# Altium schematic sheet Connection Socket.SchDoc: B100AA Connection Socket
size A3
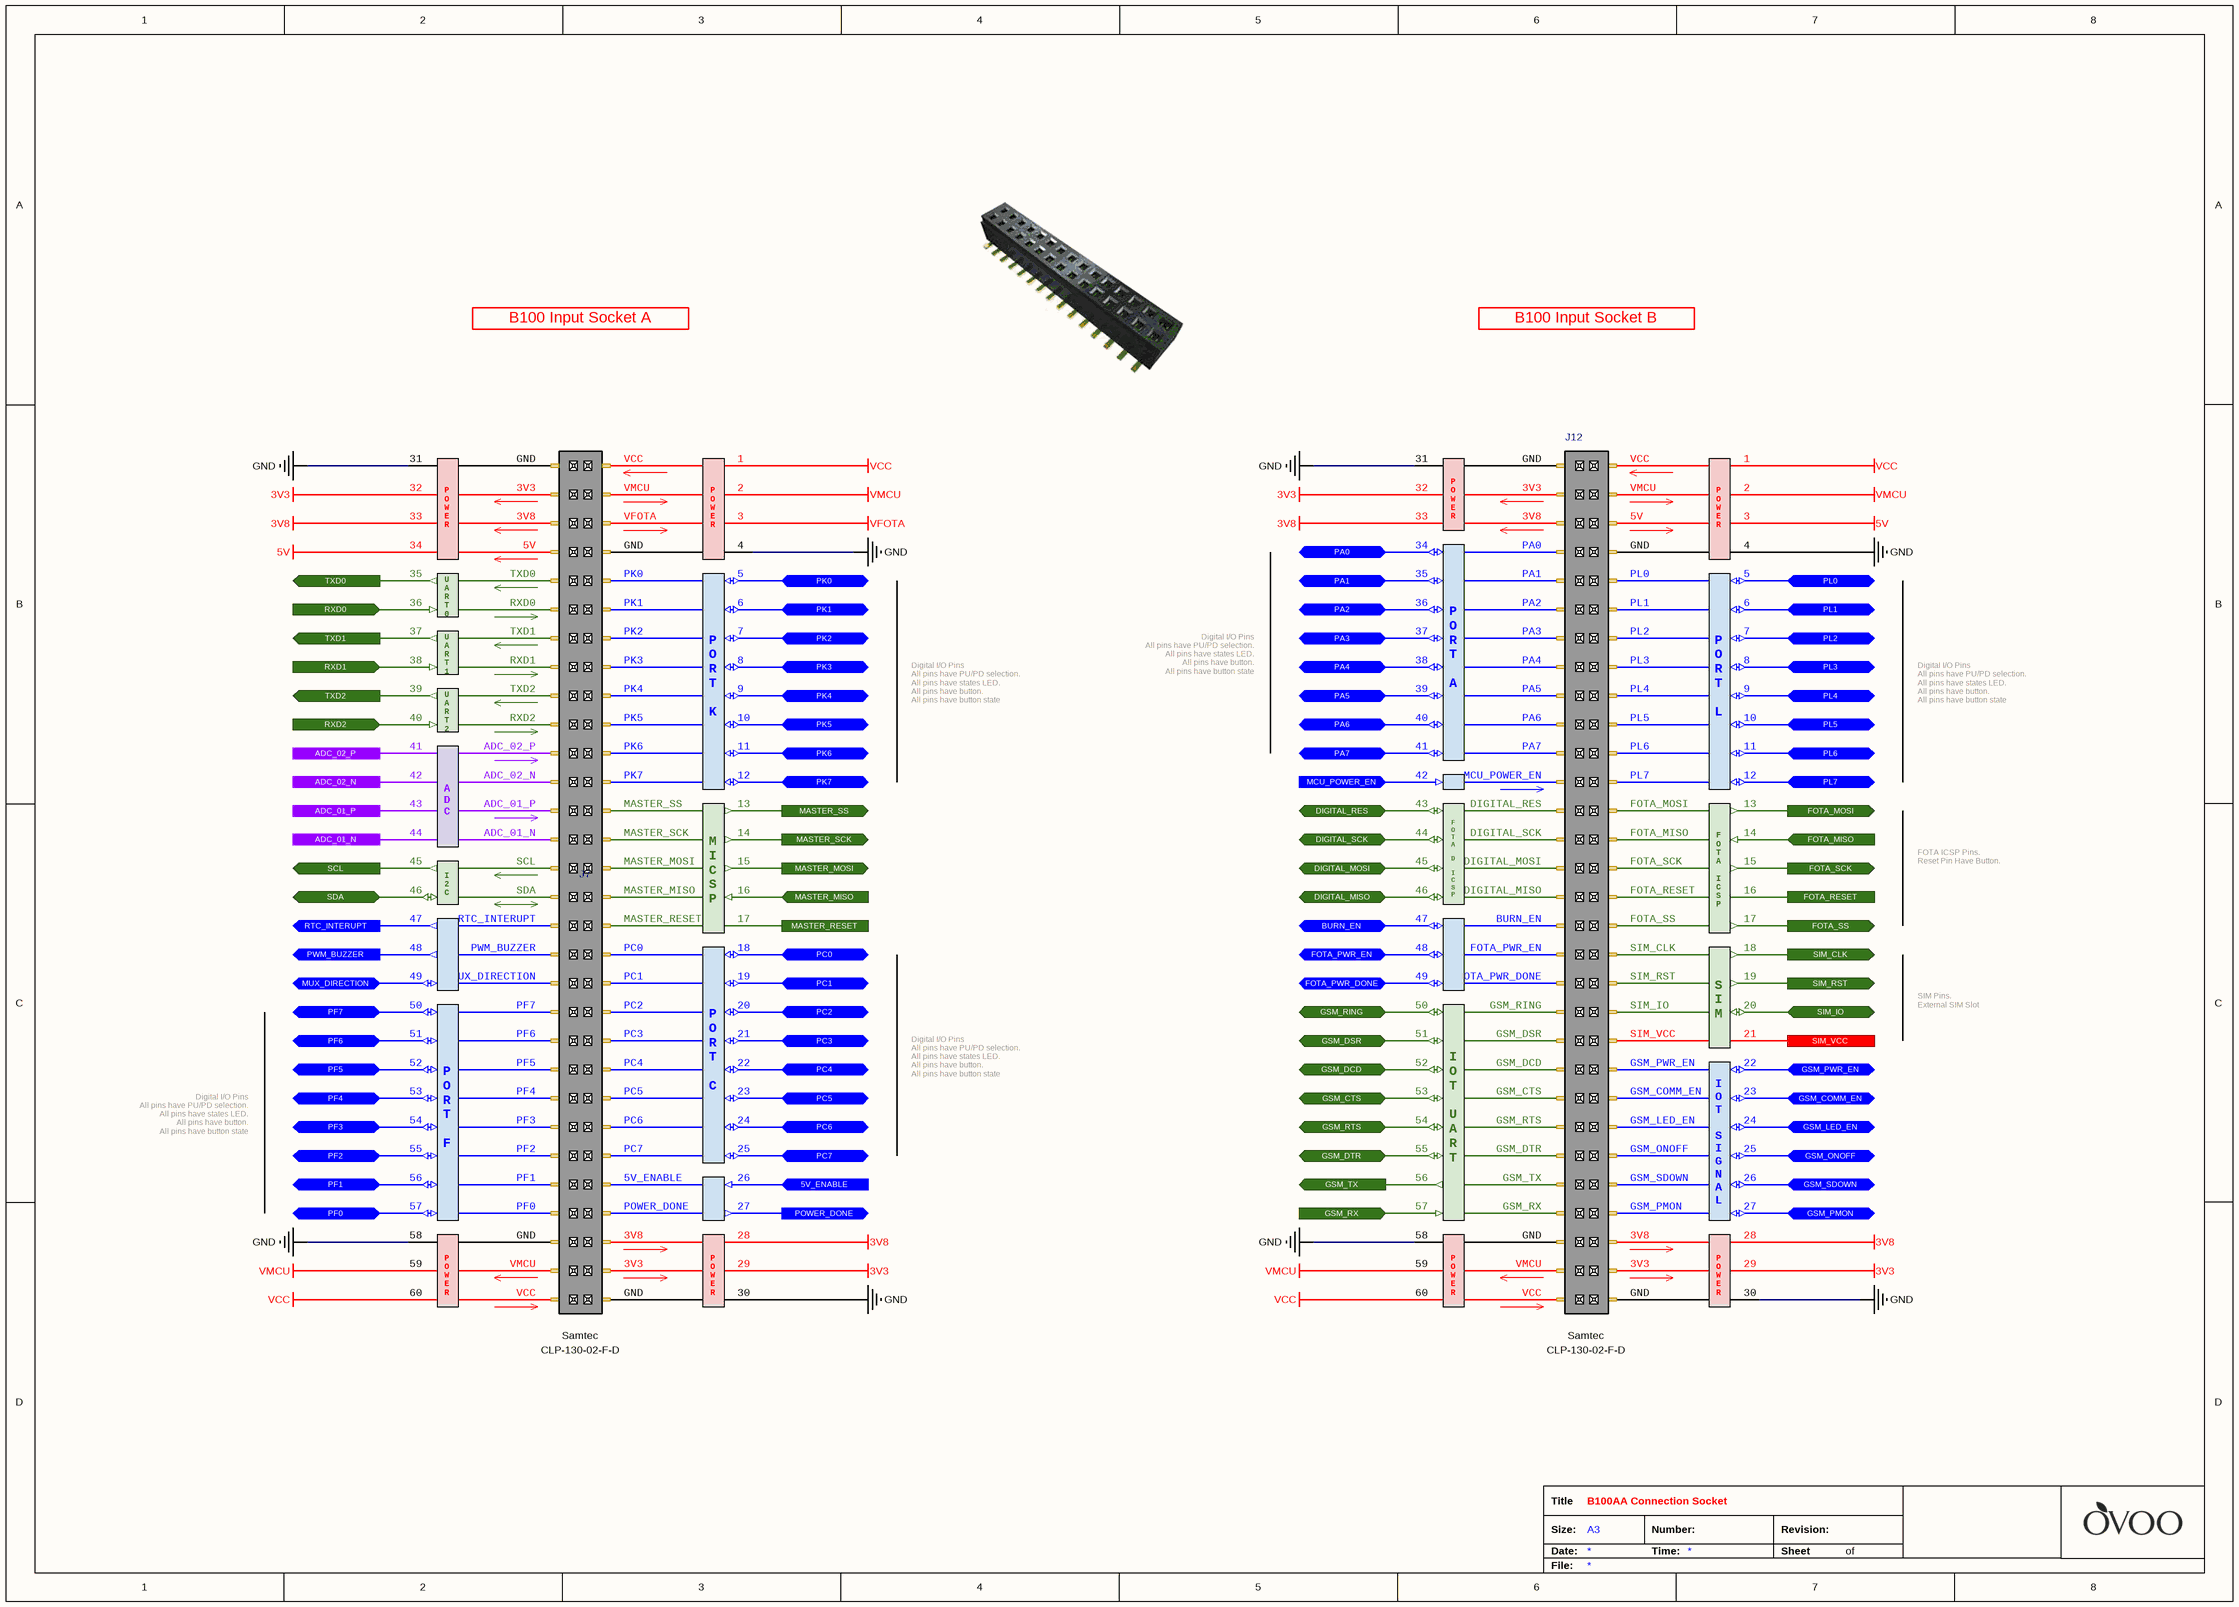
[diagram p0: Connection Socket.SchDoc]

## Parts
J7  Manufacturer Part Number: CLP-130-02-F-D  Manufacturer Name: Samtec  [SAMTEC-CLP-130-02-X-D]  (hidden comment: 1.27 mm Pitch 2x30P Female Connector)
J12  Manufacturer Part Number: CLP-130-02-F-D  Manufacturer Name: Samtec  [SAMTEC-CLP-130-02-X-D]  (hidden comment: 1.27 mm Pitch 2x30P Female Connector)

## Ports
5V_ENABLE (in), ADC_01_N, ADC_01_P, ADC_02_N, ADC_02_P, BURN_EN (bidir), DIGITAL_MISO (bidir), DIGITAL_MOSI (bidir), DIGITAL_RES (bidir), DIGITAL_SCK (bidir), FOTA_MISO (in), FOTA_MOSI (out), FOTA_PWR_DONE (bidir), FOTA_PWR_EN (bidir), FOTA_RESET, FOTA_SCK (out), FOTA_SS (out), GSM_COMM_EN (bidir), GSM_CTS (bidir), GSM_DCD (bidir), GSM_DSR (bidir), GSM_DTR (bidir), GSM_LED_EN (bidir), GSM_ONOFF (bidir), GSM_PMON (bidir), GSM_PWR_EN (bidir), GSM_RING (bidir), GSM_RTS (bidir), GSM_RX (in), GSM_SDOWN (bidir), GSM_TX (out), MASTER_MISO (in), MASTER_MOSI (out), MASTER_RESET, MASTER_SCK (out), MASTER_SS (out), MCU_POWER_EN (in), MUX_DIRECTION (bidir), PA0 (bidir), PA1 (bidir), PA2 (bidir), PA3 (bidir), PA4 (bidir), PA5 (bidir), PA6 (bidir), PA7 (bidir), PC0 (bidir), PC1 (bidir), PC2 (bidir), PC3 (bidir), PC4 (bidir), PC5 (bidir), PC6 (bidir), PC7 (bidir), PF0 (bidir), PF1 (bidir), PF2 (bidir), PF3 (bidir), PF4 (bidir), PF5 (bidir), PF6 (bidir), PF7 (bidir), PK0 (bidir), PK1 (bidir), PK2 (bidir), PK3 (bidir), PK4 (bidir), PK5 (bidir), PK6 (bidir), PK7 (bidir), PL0 (bidir), PL1 (bidir), PL2 (bidir), PL3 (bidir), PL4 (bidir), PL5 (bidir), PL6 (bidir), PL7 (bidir), POWER_DONE (out), PWM_BUZZER (out), RTC_INTERUPT (out), RXD0 (in), RXD1 (in), RXD2 (in), SCL (out), SDA (bidir), SIM_CLK (out), SIM_IO (bidir), SIM_RST (out), SIM_VCC, TXD0 (out), TXD1 (out), TXD2 (out)

## Nets
3V3: J7.29(Pin-29) J7.32(Pin-32) J12.29(Pin-29) J12.32(Pin-32)
3V8: J7.28(Pin-28) J7.33(Pin-33) J12.28(Pin-28) J12.33(Pin-33)
5V: J7.34(Pin-34) J12.3(Pin-3)
GND: J7.4(Pin-4) J7.30(Pin-30) J7.31(Pin-31) J7.58(Pin-58) J12.4(Pin-4) J12.30(Pin-30) J12.31(Pin-31) J12.58(Pin-58)
VCC: J7.1(Pin-1) J7.60(Pin-60) J12.1(Pin-1) J12.60(Pin-60)
VFOTA: J7.3(Pin-3)
VMCU: J7.2(Pin-2) J7.59(Pin-59) J12.2(Pin-2) J12.59(Pin-59)
5V_ENABLE: J7.26(Pin-26) ; port 5V_ENABLE
ADC_01_N: J7.44(Pin-44) ; port ADC_01_N
ADC_01_P: J7.43(Pin-43) ; port ADC_01_P
ADC_02_N: J7.42(Pin-42) ; port ADC_02_N
ADC_02_P: J7.41(Pin-41) ; port ADC_02_P
BURN_EN: J12.47(Pin-47) ; port BURN_EN
DIGITAL_MISO: J12.46(Pin-46) ; port DIGITAL_MISO
DIGITAL_MOSI: J12.45(Pin-45) ; port DIGITAL_MOSI
DIGITAL_RES: J12.43(Pin-43) ; port DIGITAL_RES
DIGITAL_SCK: J12.44(Pin-44) ; port DIGITAL_SCK
FOTA_MISO: J12.14(Pin-14) ; port FOTA_MISO
FOTA_MOSI: J12.13(Pin-13) ; port FOTA_MOSI
FOTA_PWR_DONE: J12.49(Pin-49) ; port FOTA_PWR_DONE
FOTA_PWR_EN: J12.48(Pin-48) ; port FOTA_PWR_EN
FOTA_RESET: J12.16(Pin-16) ; port FOTA_RESET
FOTA_SCK: J12.15(Pin-15) ; port FOTA_SCK
FOTA_SS: J12.17(Pin-17) ; port FOTA_SS
GSM_COMM_EN: J12.23(Pin-23) ; port GSM_COMM_EN
GSM_CTS: J12.53(Pin-53) ; port GSM_CTS
GSM_DCD: J12.52(Pin-52) ; port GSM_DCD
GSM_DSR: J12.51(Pin-51) ; port GSM_DSR
GSM_DTR: J12.55(Pin-55) ; port GSM_DTR
GSM_LED_EN: J12.24(Pin-24) ; port GSM_LED_EN
GSM_ONOFF: J12.25(Pin-25) ; port GSM_ONOFF
GSM_PMON: J12.27(Pin-27) ; port GSM_PMON
GSM_PWR_EN: J12.22(Pin-22) ; port GSM_PWR_EN
GSM_RING: J12.50(Pin-50) ; port GSM_RING
GSM_RTS: J12.54(Pin-54) ; port GSM_RTS
GSM_RX: J12.57(Pin-57) ; port GSM_RX
GSM_SDOWN: J12.26(Pin-26) ; port GSM_SDOWN
GSM_TX: J12.56(Pin-56) ; port GSM_TX
MASTER_MISO: J7.16(Pin-16) ; port MASTER_MISO
MASTER_MOSI: J7.15(Pin-15) ; port MASTER_MOSI
MASTER_RESET: J7.17(Pin-17) ; port MASTER_RESET
MASTER_SCK: J7.14(Pin-14) ; port MASTER_SCK
MASTER_SS: J7.13(Pin-13) ; port MASTER_SS
MCU_POWER_EN: J12.42(Pin-42) ; port MCU_POWER_EN
MUX_DIRECTION: J7.49(Pin-49) ; port MUX_DIRECTION
PA0: J12.34(Pin-34) ; port PA0
PA1: J12.35(Pin-35) ; port PA1
PA2: J12.36(Pin-36) ; port PA2
PA3: J12.37(Pin-37) ; port PA3
PA4: J12.38(Pin-38) ; port PA4
PA5: J12.39(Pin-39) ; port PA5
PA6: J12.40(Pin-40) ; port PA6
PA7: J12.41(Pin-41) ; port PA7
PC0: J7.18(Pin-18) ; port PC0
PC1: J7.19(Pin-19) ; port PC1
PC2: J7.20(Pin-20) ; port PC2
PC3: J7.21(Pin-21) ; port PC3
PC4: J7.22(Pin-22) ; port PC4
PC5: J7.23(Pin-23) ; port PC5
PC6: J7.24(Pin-24) ; port PC6
PC7: J7.25(Pin-25) ; port PC7
PF0: J7.57(Pin-57) ; port PF0
PF1: J7.56(Pin-56) ; port PF1
PF2: J7.55(Pin-55) ; port PF2
PF3: J7.54(Pin-54) ; port PF3
PF4: J7.53(Pin-53) ; port PF4
PF5: J7.52(Pin-52) ; port PF5
PF6: J7.51(Pin-51) ; port PF6
PF7: J7.50(Pin-50) ; port PF7
PK0: J7.5(Pin-5) ; port PK0
PK1: J7.6(Pin-6) ; port PK1
PK2: J7.7(Pin-7) ; port PK2
PK3: J7.8(Pin-8) ; port PK3
PK4: J7.9(Pin-9) ; port PK4
PK5: J7.10(Pin-10) ; port PK5
PK6: J7.11(Pin-11) ; port PK6
PK7: J7.12(Pin-12) ; port PK7
PL0: J12.5(Pin-5) ; port PL0
PL1: J12.6(Pin-6) ; port PL1
PL2: J12.7(Pin-7) ; port PL2
PL3: J12.8(Pin-8) ; port PL3
PL4: J12.9(Pin-9) ; port PL4
PL5: J12.10(Pin-10) ; port PL5
PL6: J12.11(Pin-11) ; port PL6
PL7: J12.12(Pin-12) ; port PL7
POWER_DONE: J7.27(Pin-27) ; port POWER_DONE
PWM_BUZZER: J7.48(Pin-48) ; port PWM_BUZZER
RTC_INTERUPT: J7.47(Pin-47) ; port RTC_INTERUPT
RXD0: J7.36(Pin-36) ; port RXD0
RXD1: J7.38(Pin-38) ; port RXD1
RXD2: J7.40(Pin-40) ; port RXD2
SCL: J7.45(Pin-45) ; port SCL
SDA: J7.46(Pin-46) ; port SDA
SIM_CLK: J12.18(Pin-18) ; port SIM_CLK
SIM_IO: J12.20(Pin-20) ; port SIM_IO
SIM_RST: J12.19(Pin-19) ; port SIM_RST
SIM_VCC: J12.21(Pin-21) ; port SIM_VCC
TXD0: J7.35(Pin-35) ; port TXD0
TXD1: J7.37(Pin-37) ; port TXD1
TXD2: J7.39(Pin-39) ; port TXD2

## Notes on the sheet
- B100 Input Socket A
- B100 Input Socket B
- Digital I/O Pins
  All pins have PU/PD selection.
  All pins have states LED.
  All pins have button.
  All pins have button state selection.
- FOTA ICSP Pins.
  Reset Pin Have Button.
- SIM Pins.
  External SIM Slot
- Title
- Size:
- Date:
- A3
- Number:
- Time:
- Revision:
- Sheet
- of
- File:
- (in symbol Connector - B100 Female Socket [A]) GND; VCC; 3V3; VMCU; 3V8; VFOTA; 5V; / P / O / W / E / R; TXD0; PK0; RXD0; PK1; U / A / R / T / 0; TXD1; PK2; RXD1; PK3; U / A / R / T / 1; TXD2; PK4; RXD2; PK5; U / A / R / T / 2; ADC_02_P; PK6; ADC_02_N; PK7; / P / O / R / T / K; ADC_01_P; MASTER_SS; ADC_01_N; MASTER_SCK; / A / D / C; SCL; MASTER_MOSI; SDA; MASTER_MISO; / I / 2 / C; RTC_INTERUPT; MASTER_RESET; / M / I / C / S / P; PWM_BUZZER; PC0; MUX_DIRECTION; PC1; PF7; PC2; PF6; PC3; PF5; PC4; PF4; PC5; PF3; PC6; PF2; PC7; / P / O / R / T / C; PF1; 5V_ENABLE; PF0; POWER_DONE; / P / O / R / T / F
- (in symbol Connector - B100 Female Socket [B]) GND; VCC; 3V3; VMCU; 3V8; 5V; / P / O / W / E / R; PA0; PA1; PL0; PA2; PL1; PA3; PL2; PA4; PL3; PA5; PL4; PA6; PL5; PA7; PL6; / P / O / R / T / A; MCU_POWER_EN; PL7; / P / O / R / T / L; DIGITAL_RES; FOTA_MOSI; DIGITAL_SCK; FOTA_MISO; DIGITAL_MOSI; FOTA_SCK; DIGITAL_MISO; FOTA_RESET; / F / O / T / A / D / I / C / S / P; BURN_EN; FOTA_SS; / F / O / T / A / I / C / S / P; FOTA_PWR_EN; SIM_CLK; FOTA_PWR_DONE; SIM_RST; GSM_RING; SIM_IO; GSM_DSR; SIM_VCC; / S / I / M; GSM_DCD; GSM_PWR_EN; GSM_CTS; GSM_COMM_EN; GSM_RTS; GSM_LED_EN; GSM_DTR; GSM_ONOFF; GSM_TX; GSM_SDOWN; GSM_RX; GSM_PMON; / I / O / T / U / A / R / T; / I / O / T / S / I / G / N / A / L

## Library data of the parts
J7 = Connector - B100 Female Socket [A]: Headers & Wire Housings BREAKAWAY HDR VERT 60; Position: 60; Row: 2; Pitch: 1.27 mm; Mouser Part Number: 200-CLP13002FD; ROHS: Yes; ComponentLink1Description: DataSheet; ComponentLink1URL: https://www.mouser.com.tr/datasheet/2/527/clp_sm-1369947.pdf; ComponentLink2Description: Mouser; ComponentLink2URL: https://www.mouser.com.tr/ProductDetail/Samtec/CLP-130-02-F-D/?qs=0lQeLiL1qybc%2FxML5BDomw%3D%3D; Supplier 1: Mouser; Supplier Part Number 1: 200-CLP13002FD; System: Connector
J12 = Connector - B100 Female Socket [B]: Headers & Wire Housings BREAKAWAY HDR VERT 60; Position: 60; Row: 2; Pitch: 1.27 mm; Mouser Part Number: 200-CLP13002FD; ROHS: Yes; ComponentLink1Description: DataSheet; ComponentLink1URL: https://www.mouser.com.tr/datasheet/2/527/clp_sm-1369947.pdf; ComponentLink2Description: Mouser; ComponentLink2URL: https://www.mouser.com.tr/ProductDetail/Samtec/CLP-130-02-F-D/?qs=0lQeLiL1qybc%2FxML5BDomw%3D%3D; Supplier 1: Mouser; Supplier Part Number 1: 200-CLP13002FD; System: Connector